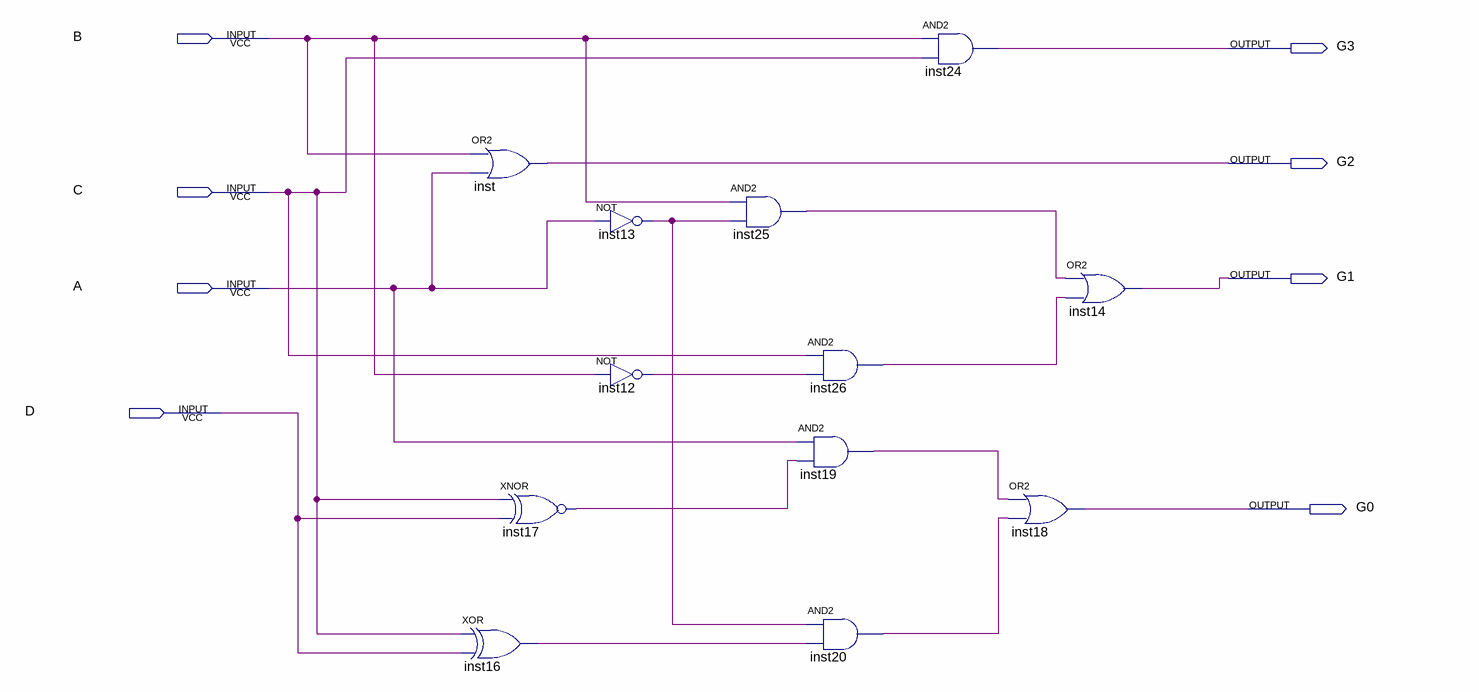
[diagram p0: schematic sheet]
// Quartus schematic 2421.bdf as structural Verilog: 12 symbols, 8 pins
module \2421  (
  input  B,
  input  C,
  input  A,
  input  D,
  output G3,
  output G2,
  output G1,
  output G0
);

  wire inst12_out, inst13_out, inst16_out, inst17_out, inst19_out, inst20_out, inst25_out, inst26_out;

  or inst (G2, B, A);
  xnor inst17 (inst17_out, C, D);
  xor inst16 (inst16_out, C, D);
  not inst13 (inst13_out, A);
  not inst12 (inst12_out, B);
  and inst25 (inst25_out, B, inst13_out);
  and inst26 (inst26_out, C, inst12_out);
  and inst19 (inst19_out, A, inst17_out);
  and inst20 (inst20_out, inst13_out, inst16_out);
  and inst24 (G3, B, C);
  or inst14 (G1, inst25_out, inst26_out);
  or inst18 (G0, inst19_out, inst20_out);
endmodule
